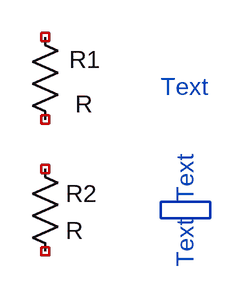
[diagram p0: schematic 13 - Text and resistors.asc]
13 - Text and resistors.asc, the LTspice schematic file:
Version 4.1
SHEET 1 880 680
WIRE 16 320 -32 320
WIRE -32 336 -32 320
WIRE 16 336 16 320
WIRE 16 336 -32 336
SYMBOL res -160 144 R0
WINDOW 0 39 38 Left 2
WINDOW 3 45 81 Left 2
SYMATTR InstName R1
SYMBOL res -160 272 R0
SYMATTR InstName R2
TEXT -32 208 Left 2 ;Text
TEXT -8 336 VRight 2 ;Text
TEXT -8 320 VLeft 2 ;Text

The netlist it stands for:
* 13 - Text and resistors.asc
R1 NC_01 NC_02 R
R2 NC_03 NC_04 R
* Text
* Text
* Text
.backanno
.end